# EAGLE design pmod-64x64-rgb-led-matrix-adapter (EAGLE 7.7.0)
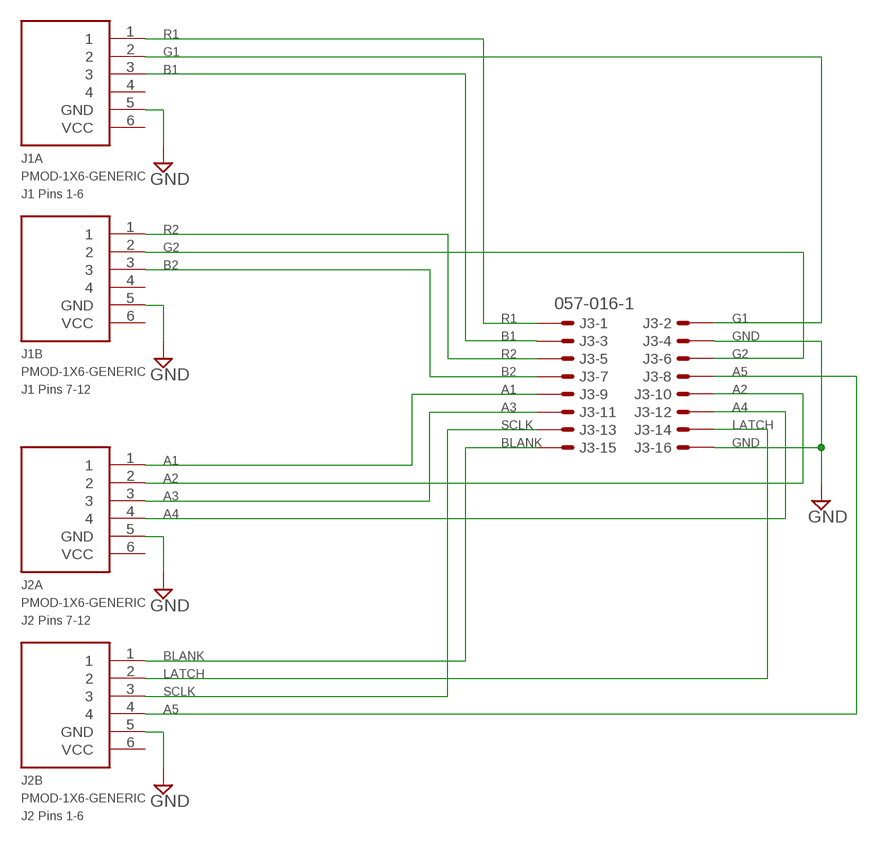
[diagram p0: schematic, sheet 1]

## Parts
J1A  PMOD-1X6-GENERIC  [CON-PMOD-1X6]
J1B  PMOD-1X6-GENERIC  [CON-PMOD-1X6]
J2A  PMOD-1X6-GENERIC  [CON-PMOD-1X6]
J2B  PMOD-1X6-GENERIC  [CON-PMOD-1X6]
J3  057-016-1  [057-016-1]

## Nets
A1: J2A.1 J3.9
A2: J2A.2 J3.10
A3: J2A.3 J3.11
A4: J2A.4 J3.12
A5: J2B.4 J3.8
B1: J1A.3 J3.3
B2: J1B.3 J3.7
BLANK: J2B.1 J3.15
G1: J1A.2 J3.2
G2: J1B.2 J3.6
GND: J1A.5(GND) J1B.5(GND) J2A.5(GND) J2B.5(GND) J3.4 J3.16
LATCH: J2B.2 J3.14
R1: J1A.1 J3.1
R2: J1B.1 J3.5
SCLK: J2B.3 J3.13
Unconnected: J1A.4 J1A.6(VCC) J1B.4 J1B.6(VCC) J2A.6(VCC) J2B.6(VCC)

## Notes on the sheet
- J1 Pins 1-6
- J1 Pins 7-12
- J2 Pins 7-12
- J2 Pins 1-6

## Library data of the parts
J1A J1B J2A J2B = 0GlenConnectors:PMOD-1X6-GENERIC
J3 = con-panduit:057-016-: CONNECTOR 10-pin series 057 contact pc board low profile headers; OC_FARNELL: unknown; OC_NEWARK: unknown

## Board
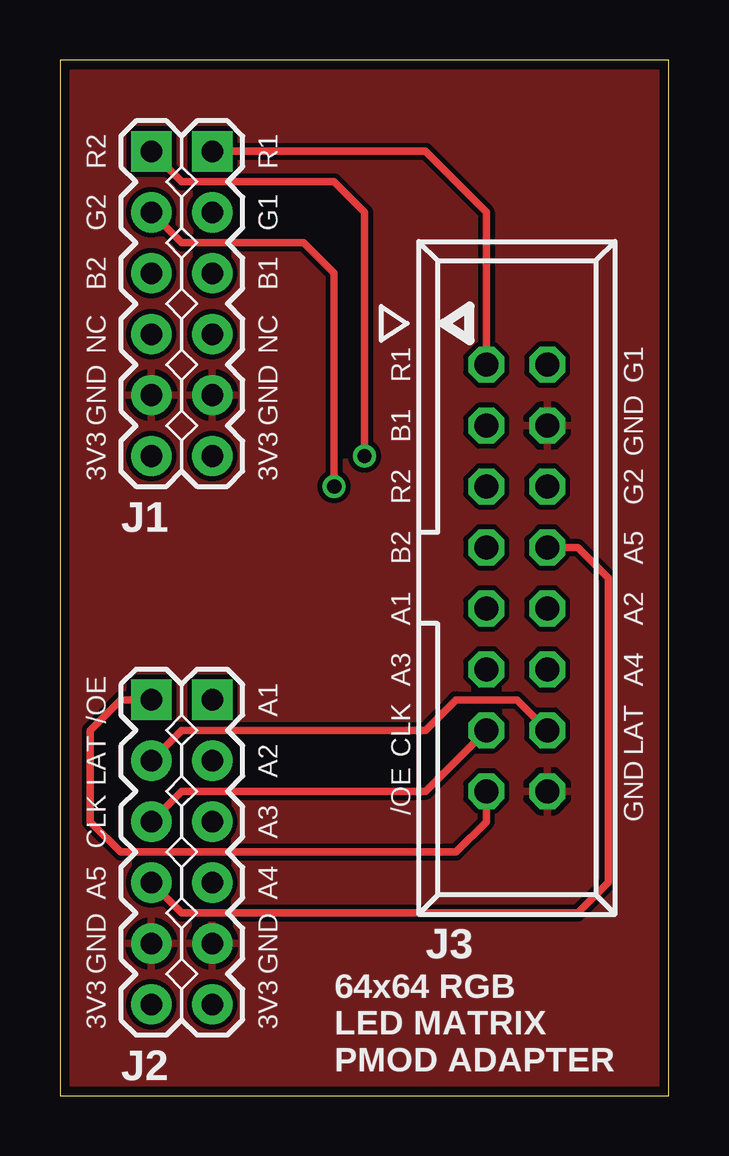
[diagram p1: board, top side]
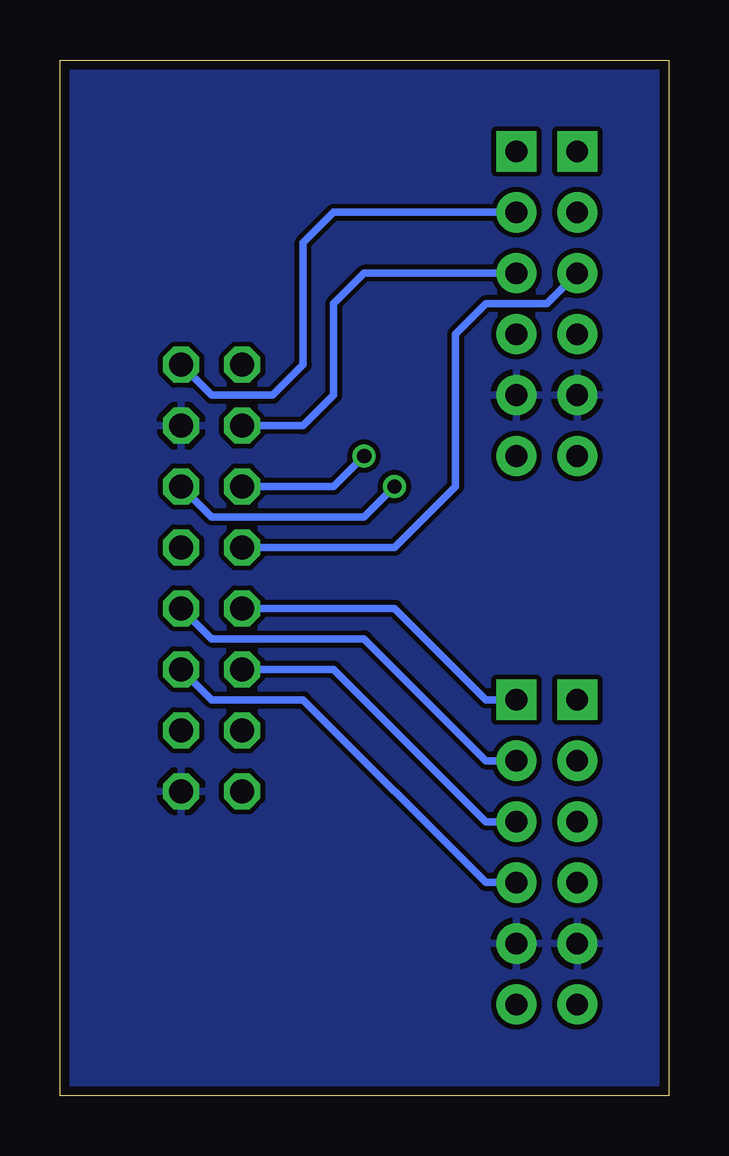
[diagram p2: board, bottom side, seen from below]

Size 25.38 x 43.18 mm. Coordinates in mm from the lower left corner, seen from the top.
Outline: 0,0 25.38,0 25.38,43.18 0,43.18 0,0
Copper layers (1*16): Top 0.0356mm / dielectric 1.5011mm / Bottom 0.0356mm
Design rules "LaenPCBOrder": minimum track width 6mil, minimum drill 13mil, track to track 6mil, track to pad 6mil, pad to pad 6mil, via to via 6mil, smd to smd 6mil, copper to edge 15mil, drill to drill 6mil, minimum pad ring 7mil, minimum via ring 7mil, stop-mask expansion 4mil, vias tented up to drill 0mil, thermal gap 10mil

### Footprints (pad centres in the part's own frame; a part is rotated, then mirrored left to right if it is on the bottom)
CON-PMOD-1X6 = drill 0.9 pad 1.676 square: 1 0,6.35 | drill 0.9 pad 1.676: 2 0,3.81; 3 0,1.27; 4 0,-1.27; 5 0,-3.81; 6 0,-6.35
057-016-1 = drill 1 octagon: 1 -8.89,-1.27; 2 -8.89,1.27; 3 -6.35,-1.27; 4 -6.35,1.27; 5 -3.81,-1.27; 6 -3.81,1.27; 7 -1.27,-1.27; 8 -1.27,1.27; 9 1.27,-1.27; 10 1.27,1.27; 11 3.81,-1.27; 12 3.81,1.27; 13 6.35,-1.27; 14 6.35,1.27; 15 8.89,-1.27; 16 8.89,1.27

### Placement (x,y rotation side)
J1A  6.35,33.02 0 top
J1B  3.81,33.02 0 top
J2A  6.35,10.16 0 top
J2B  3.81,10.16 0 top
J3  19.05,21.59 270 top

### Tracks (layer width: path | path; a pad name or v marks a point on that pad's centre or on a via)
A1
  Bottom 0.305: J2A.1 7.62,16.51 11.43,20.32 J3.9
A2
  Bottom 0.305: J3.10 19.05,19.05 12.7,19.05 7.62,13.97 J2A.2
A3
  Bottom 0.305: J2A.3 7.62,11.43 13.97,17.78 J3.11
A4
  Bottom 0.305: J3.12 19.05,16.51 15.24,16.51 7.62,8.89 J2A.4
A5
  Top 0.305: J2B.4 5.08,7.62 21.59,7.62 22.86,8.89 22.86,21.59 21.59,22.86 J3.8
B1
  Bottom 0.305: J1A.3 12.7,34.29 13.97,33.02 13.97,29.21 15.24,27.94 J3.3
B2
  Bottom 0.305: J1B.3 5.08,33.02 7.62,33.02 8.89,31.75 8.89,25.4 11.43,22.86 J3.7
BLANK
  Top 0.305: J2B.1 2.54,16.51 1.27,15.24 1.27,11.43 2.54,10.16 16.51,10.16 17.78,11.43 J3.15
G1
  Bottom 0.305: J3.2 19.05,29.21 16.51,29.21 15.24,30.48 15.24,35.56 13.97,36.83 J1A.2
G2  (via drill 0.6)
  Top 0.305: J1B.2 5.08,35.56 10.16,35.56 11.43,34.29 v11.43,25.4
  Bottom 0.305: v11.43,25.4 12.7,24.13 19.05,24.13 J3.6
GND
  pour Bottom (isolate 0.203): 0,43.18 0,0 25.4,0 25.4,43.18
  pour Top (isolate 0.203): 0,0 25.4,0 25.4,43.18 0,43.18
LATCH
  Top 0.305: J2B.2 5.08,15.24 15.24,15.24 16.51,16.51 19.05,16.51 J3.14
R1
  Top 0.305: J1A.1 15.24,39.37 17.78,36.83 J3.1
R2  (via drill 0.6)
  Top 0.305: J1B.1 5.08,38.1 11.43,38.1 12.7,36.83 v12.7,26.67
  Bottom 0.305: v12.7,26.67 13.97,25.4 J3.5
SCLK
  Top 0.305: J2B.3 5.08,12.7 15.24,12.7 J3.13

### Text on the board
_tsilk: R2 | R1 | G2 | G1 | B2 | B1 | NC | NC | R1 | G1 | GND | GND | B1 | GND | 3V3 | 3V3 | J1 | R2 | G2 | B2 | A5 | A1 | A2 | A3 | A4 | /OE | A1 | CLK | LAT | LAT | A2 | /OE | GND | CLK | A3 | A5 | A4 | J3 | GND | GND | 64x64 RGB / LED MATRIX / PMOD ADAPTER | 3V3 | 3V3 | J2